# Altium project TMDX654GPEVM.PrjPcb (part 11 of 24)

## Sheet 28-MIPI 60 PIN CONNECTOR.SchDoc
size 513 x 386 mm
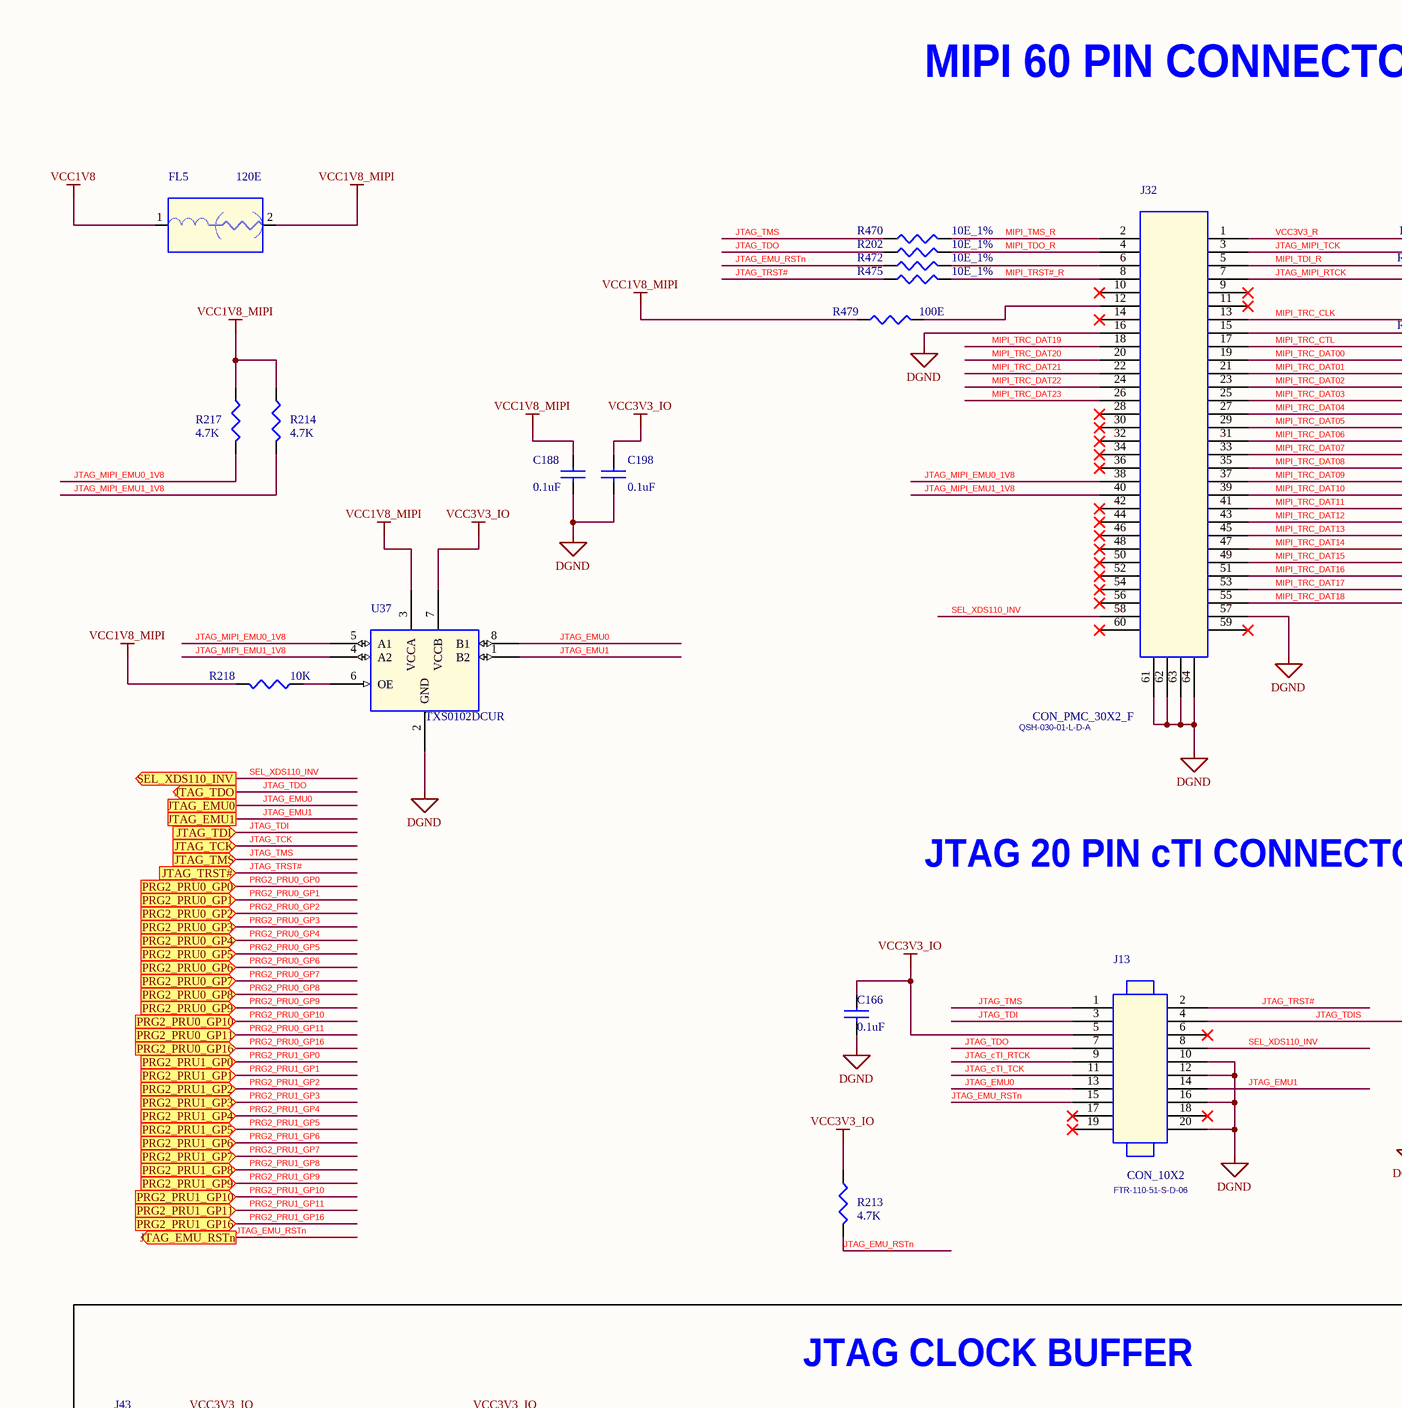
[diagram p48: 28-MIPI 60 PIN CONNECTOR.SchDoc, top left]
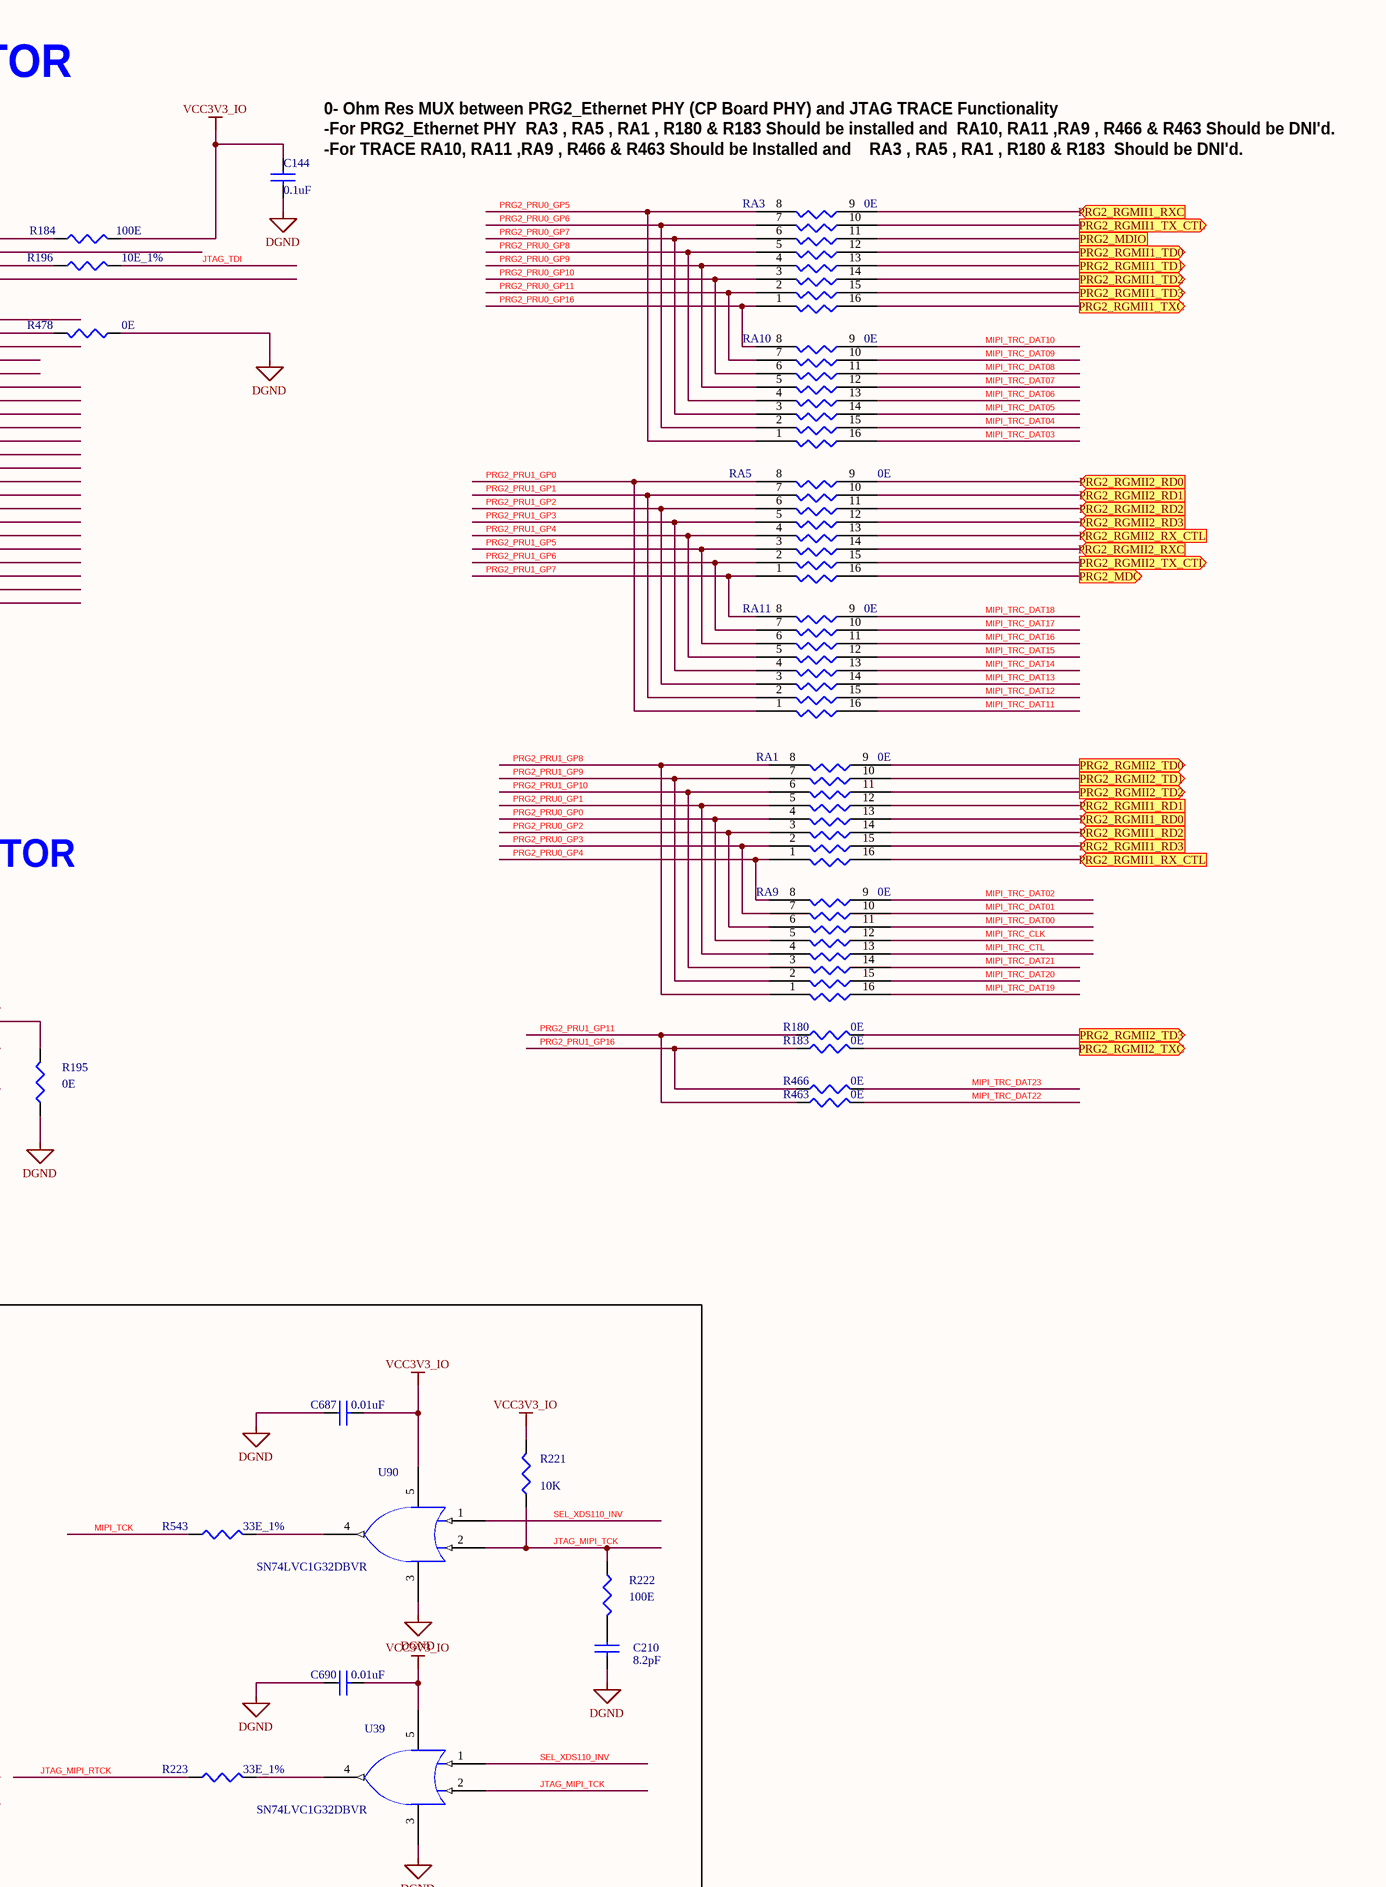
[diagram p49: 28-MIPI 60 PIN CONNECTOR.SchDoc, top right]
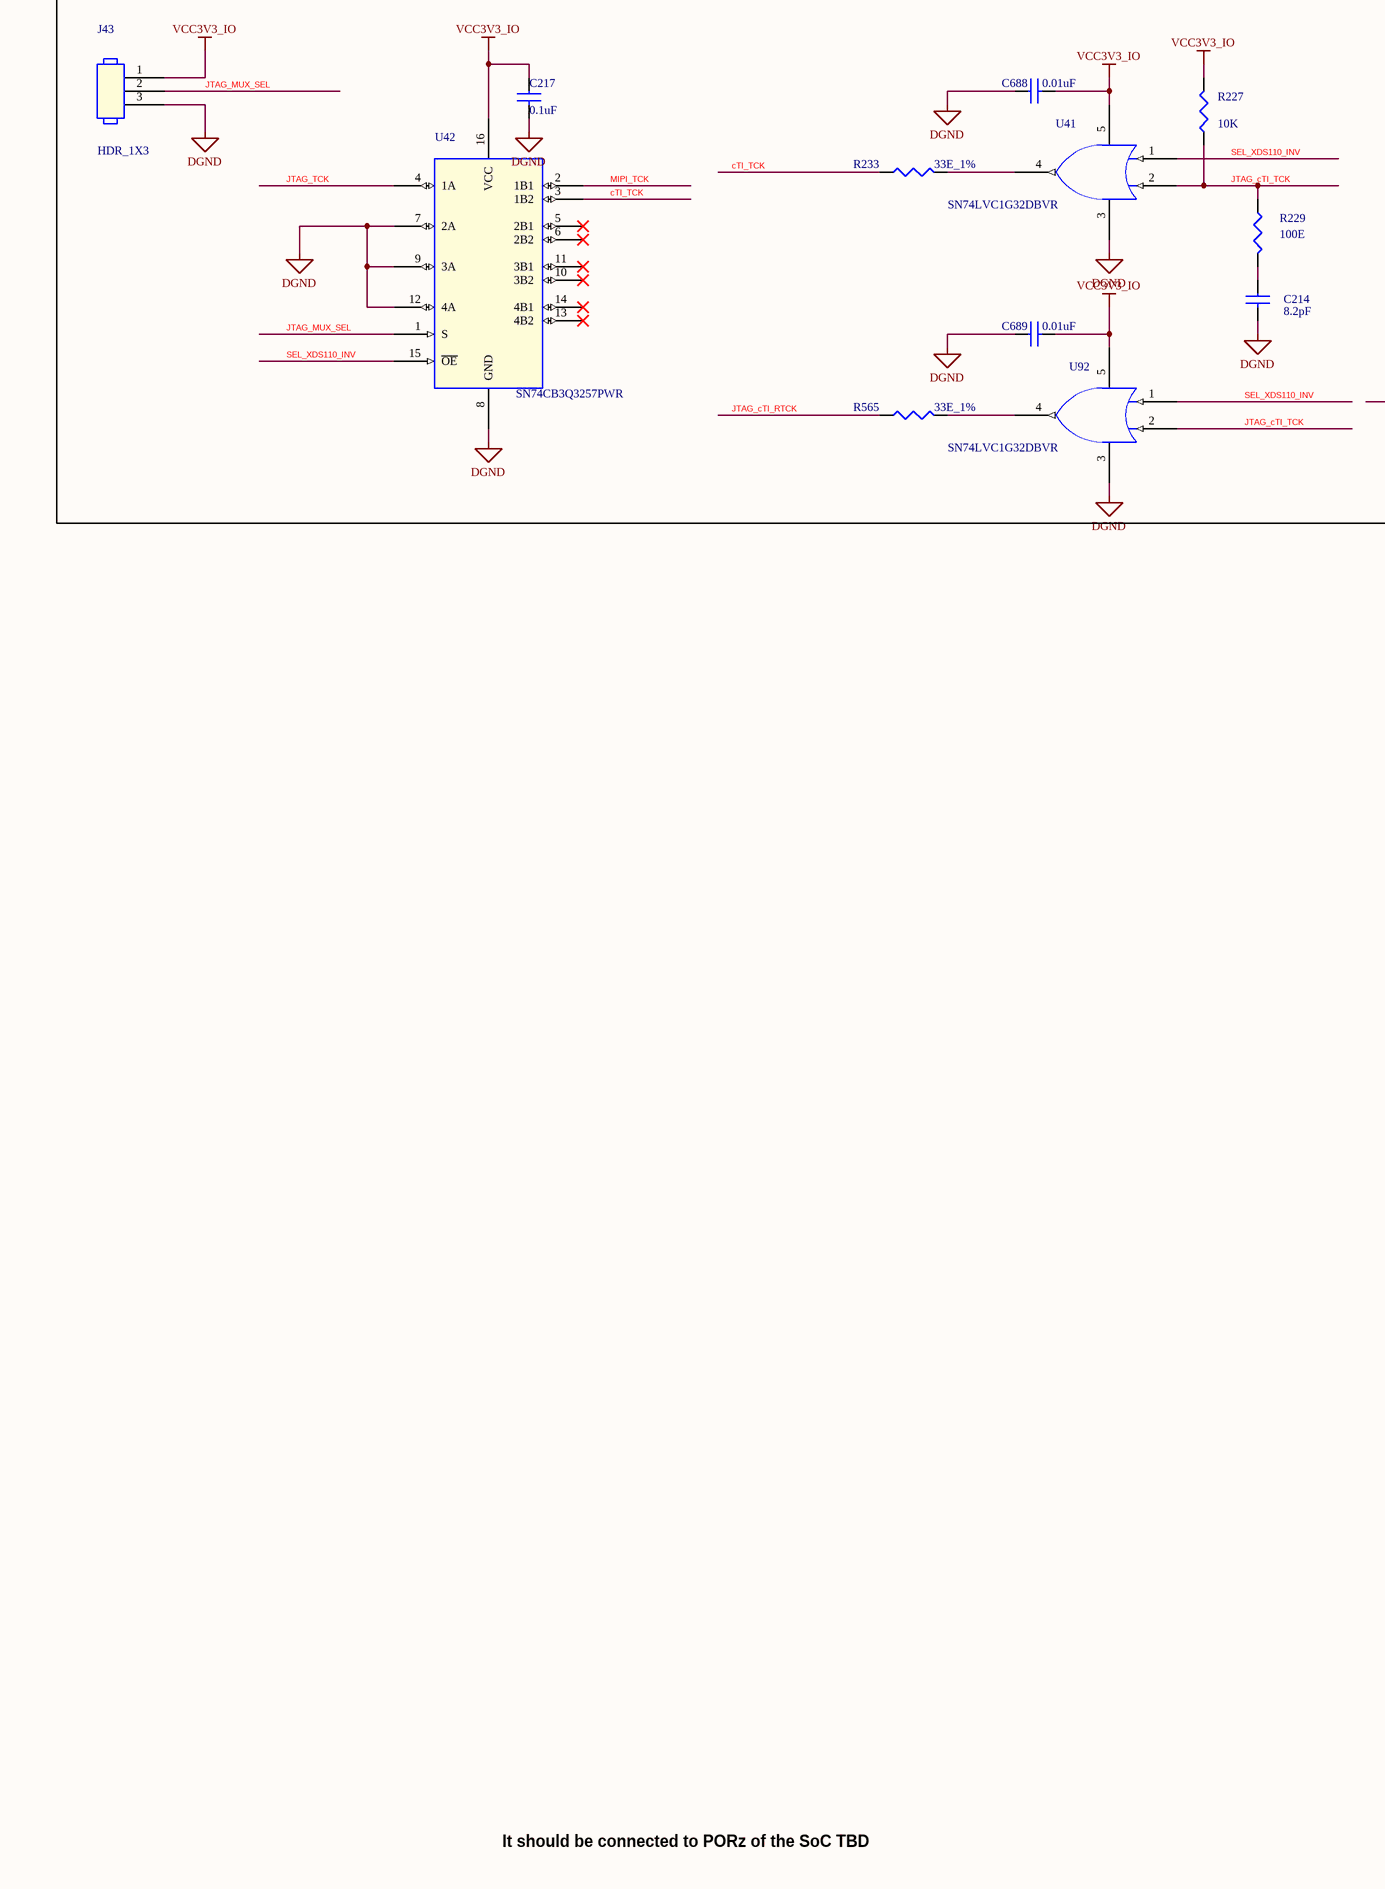
[diagram p50: 28-MIPI 60 PIN CONNECTOR.SchDoc, bottom left]
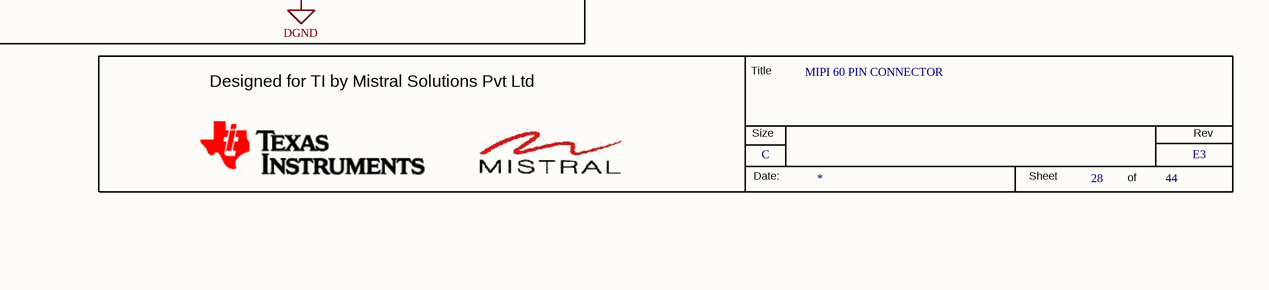
[diagram p51: 28-MIPI 60 PIN CONNECTOR.SchDoc, bottom right]

### Parts
(Parts that share a designator on the sheet are numbered #1, #2 ... from top to bottom, then left to right.)
*#28  RevCode: E3  Title: MIPI 60 PIN CONNECTOR  Page Size: C  Page Number: 28  Page Count: 44  (hidden comment: MISTRAL_TITLEBLK_CSIZE)  (graphical)
C144  0.1uF  [CAP0201_0-5]
C166  0.1uF  [CAP0201_0-5]
C188  0.1uF  [CAP0201_0-5]
C198  0.1uF  [CAP0201_0-5]
C210  8.2pF  [CAP0402_0-75]
C214  8.2pF  [CAP0402_0-75]
C217  0.1uF  [CAP0201_0-5]
C687  0.01uF  [CAP0201_0-5]
C688  0.01uF  [CAP0201_0-5]
C689  0.01uF  [CAP0201_0-5]
C690  0.01uF  [CAP0201_0-5]
FL5  120E  [EMIFIL_BLM15A_0402_0-6]
J13  CON_10X2  Mfr_part_number: FTR-110-51-S-D-06  [CON_10X2_FTR-110-51-S-D_P_S_S]
J32  CON_PMC_30X2_F  Mfr_part_number: QSH-030-01-L-D-A  [CON_PMC30X2_QSH-030-01-L_S_S_S]
J43  HDR_1X3  [HDR_3X1_100_S_T]
R180  0E  [RES0402_0-5]
R183  0E  [RES0402_0-5]
R184  100E  [RES0402_0-5]
R195  0E  [RES0402_0-5]
R196  10E_1%  [RES0402_0-5]
R202  10E_1%  [RES0402_0-5]
R213  4.7K  [RES0402]
R214  4.7K  [RES0402]
R217  4.7K  [RES0402]
R218  10K  [RES0402_0-5]
R221  10K  [RES0402_0-5]
R222  100E  [RES0402_0-5]
R223  33E_1%  [RES0402_0-5]
R227  10K  [RES0402_0-5]
R229  100E  [RES0402_0-5]
R233  33E_1%  [RES0402_0-5]
R463  0E  [RES0402_0-5]
R466  0E  [RES0402_0-5]
R470  10E_1%  [RES0402_0-5]
R472  10E_1%  [RES0402_0-5]
R475  10E_1%  [RES0402_0-5]
R478  0E  [RES0402_0-5]
R479  100E  [RES0402_0-5]
R543  33E_1%  [RES0402_0-5]
R565  33E_1%  [RES0402_0-5]
RA1  0E  [RESA_0402-8]
RA3  0E  [RESA_0402-8]
RA5  0E  [RESA_0402-8]
RA9  0E  [RESA_0402-8]
RA10  0E  [RESA_0402-8]
RA11  0E  [RESA_0402-8]
U37  TXS0102DCUR  [VSSOP8_19-68_85X95_0-9]
U39  SN74LVC1G32DBVR  [SOT23-5_1-5]
U41  SN74LVC1G32DBVR  [SOT23-5_1-5]
U42  SN74CB3Q3257PWR  [TSSOP16_25-59_205X180]
U90  SN74LVC1G32DBVR  [SOT23-5_1-5]
U92  SN74LVC1G32DBVR  [SOT23-5_1-5]

### Blocks framed on the sheet
JTAG CLOCK BUFFER: C210 C214 C217 C687-C690 J43 R221-R223 R227 R229 R233 R543 R565 U39 U41 U42 U90 U92

### Ports
JTAG_EMU0, JTAG_EMU1, JTAG_EMU_RSTn (out), JTAG_TCK (in), JTAG_TDI (in), JTAG_TDO (out), JTAG_TMS (in), JTAG_TRST# (in), PRG2_MDC (out), PRG2_MDIO, PRG2_PRU0_GP0 (in), PRG2_PRU0_GP1 (in), PRG2_PRU0_GP2 (in), PRG2_PRU0_GP3 (in), PRG2_PRU0_GP4 (in), PRG2_PRU0_GP5 (in), PRG2_PRU0_GP6 (in), PRG2_PRU0_GP7 (in), PRG2_PRU0_GP8 (in), PRG2_PRU0_GP9 (in), PRG2_PRU0_GP10 (in), PRG2_PRU0_GP11 (in), PRG2_PRU0_GP16 (in), PRG2_PRU1_GP0 (in), PRG2_PRU1_GP1 (in), PRG2_PRU1_GP2 (in), PRG2_PRU1_GP3 (in), PRG2_PRU1_GP4 (in), PRG2_PRU1_GP5 (in), PRG2_PRU1_GP6 (in), PRG2_PRU1_GP7 (in), PRG2_PRU1_GP8 (in), PRG2_PRU1_GP9 (in), PRG2_PRU1_GP10 (in), PRG2_PRU1_GP11 (in), PRG2_PRU1_GP16 (in), PRG2_RGMII1_RD0 (in), PRG2_RGMII1_RD1 (in), PRG2_RGMII1_RD2 (in), PRG2_RGMII1_RD3 (in), PRG2_RGMII1_RX_CTL (in), PRG2_RGMII1_RXC (in), PRG2_RGMII1_TD0 (out), PRG2_RGMII1_TD1 (out), PRG2_RGMII1_TD2 (out), PRG2_RGMII1_TD3 (out), PRG2_RGMII1_TX_CTL (out), PRG2_RGMII1_TXC (out), PRG2_RGMII2_RD0 (in), PRG2_RGMII2_RD1 (in), PRG2_RGMII2_RD2 (in), PRG2_RGMII2_RD3 (in), PRG2_RGMII2_RX_CTL (in), PRG2_RGMII2_RXC (in), PRG2_RGMII2_TD0 (out), PRG2_RGMII2_TD1 (out), PRG2_RGMII2_TD2 (out), PRG2_RGMII2_TD3 (out), PRG2_RGMII2_TX_CTL (out), PRG2_RGMII2_TXC (out), SEL_XDS110_INV (out)

### Nets
DGND: C144.2 C166.2 C188.2 C198.2 C210.2 C214.2 C217.2 C687.1 C688.1 C689.1 C690.1 J13.10 J13.12 J13.16 J13.20 J32.16 J32.57 J32.61 J32.62 J32.63 J32.64 J43.3 R195.1 R478.1 U37.2(GND) U39.3(GND) U41.3(GND) U42.7(2A) U42.8(GND) U42.9(3A) U42.12(4A) U90.3(GND) U92.3(GND)
VCC1V8: FL5.1
VCC1V8_MIPI: C188.1 FL5.2 R214.1 R217.1 R218.2 R479.1 U37.3(VCCA)
VCC3V3_IO: C144.1 C166.1 C198.1 C217.1 C687.2 C688.2 C689.2 C690.2 J13.5 J43.1 R184.2 R213.1 R221.2 R227.2 U37.7(VCCB) U39.5(VCC) U41.5(VCC) U42.16(VCC) U90.5(VCC) U92.5(VCC)
cTI_TCK: R233.1 U42.3(1B2)
JTAG_cTI_RTCK: J13.9 R565.1
JTAG_cTI_TCK: J13.11 R227.1 R229.1 U41.2(B) U92.2(B)
JTAG_EMU0: J13.13 U37.8(B1) ; port JTAG_EMU0
JTAG_EMU1: J13.14 U37.1(B2) ; port JTAG_EMU1
JTAG_EMU_RSTn: J13.15 R213.2 R472.1 ; port JTAG_EMU_RSTn
JTAG_MIPI_EMU0_1V8: J32.38 R217.2 U37.5(A1)
JTAG_MIPI_EMU1_1V8: J32.40 R214.2 U37.4(A2)
JTAG_MIPI_RTCK: J32.7 R223.1
JTAG_MIPI_TCK: J32.3 R221.1 R222.1 U39.2(B) U90.2(B)
JTAG_MUX_SEL: J43.2 U42.1(S)
JTAG_TCK: U42.4(1A) ; port JTAG_TCK
JTAG_TDI: J13.3 R196.2 ; port JTAG_TDI
JTAG_TDIS: J13.4 R195.2
JTAG_TDO: J13.7 R202.1 ; port JTAG_TDO
JTAG_TMS: J13.1 R470.1 ; port JTAG_TMS
JTAG_TRST#: J13.2 R475.1 ; port JTAG_TRST#
MIPI_TCK: R543.1 U42.2(1B1)
MIPI_TDI_R: J32.5 R196.1
MIPI_TDO_R: J32.4 R202.2
MIPI_TMS_R: J32.2 R470.2
MIPI_TRC_CLK: J32.13 RA9.12
MIPI_TRC_CTL: J32.17 RA9.13
MIPI_TRC_DAT00: J32.19 RA9.11
MIPI_TRC_DAT01: J32.21 RA9.10
MIPI_TRC_DAT02: J32.23 RA9.9
MIPI_TRC_DAT03: J32.25 RA10.16
MIPI_TRC_DAT04: J32.27 RA10.15
MIPI_TRC_DAT05: J32.29 RA10.14
MIPI_TRC_DAT06: J32.31 RA10.13
MIPI_TRC_DAT07: J32.33 RA10.12
MIPI_TRC_DAT08: J32.35 RA10.11
MIPI_TRC_DAT09: J32.37 RA10.10
MIPI_TRC_DAT10: J32.39 RA10.9
MIPI_TRC_DAT11: J32.41 RA11.16
MIPI_TRC_DAT12: J32.43 RA11.15
MIPI_TRC_DAT13: J32.45 RA11.14
MIPI_TRC_DAT14: J32.47 RA11.13
MIPI_TRC_DAT15: J32.49 RA11.12
MIPI_TRC_DAT16: J32.51 RA11.11
MIPI_TRC_DAT17: J32.53 RA11.10
MIPI_TRC_DAT18: J32.55 RA11.9
MIPI_TRC_DAT19: J32.18 RA9.16
MIPI_TRC_DAT20: J32.20 RA9.15
MIPI_TRC_DAT21: J32.22 RA9.14
MIPI_TRC_DAT22: J32.24 R463.2
MIPI_TRC_DAT23: J32.26 R466.2
MIPI_TRST#_R: J32.8 R475.2
PRG2_MDC: RA5.16 ; port PRG2_MDC
PRG2_MDIO: RA3.11 ; port PRG2_MDIO
PRG2_PRU0_GP0: RA1.4 RA9.5 ; port PRG2_PRU0_GP0
PRG2_PRU0_GP1: RA1.5 RA9.4 ; port PRG2_PRU0_GP1
PRG2_PRU0_GP2: RA1.3 RA9.6 ; port PRG2_PRU0_GP2
PRG2_PRU0_GP3: RA1.2 RA9.7 ; port PRG2_PRU0_GP3
PRG2_PRU0_GP4: RA1.1 RA9.8 ; port PRG2_PRU0_GP4
PRG2_PRU0_GP5: RA3.8 RA10.1 ; port PRG2_PRU0_GP5
PRG2_PRU0_GP6: RA3.7 RA10.2 ; port PRG2_PRU0_GP6
PRG2_PRU0_GP7: RA3.6 RA10.3 ; port PRG2_PRU0_GP7
PRG2_PRU0_GP8: RA3.5 RA10.4 ; port PRG2_PRU0_GP8
PRG2_PRU0_GP9: RA3.4 RA10.5 ; port PRG2_PRU0_GP9
PRG2_PRU0_GP10: RA3.3 RA10.6 ; port PRG2_PRU0_GP10
PRG2_PRU0_GP11: RA3.2 RA10.7 ; port PRG2_PRU0_GP11
PRG2_PRU0_GP16: RA3.1 RA10.8 ; port PRG2_PRU0_GP16
PRG2_PRU1_GP0: RA5.8 RA11.1 ; port PRG2_PRU1_GP0
PRG2_PRU1_GP1: RA5.7 RA11.2 ; port PRG2_PRU1_GP1
PRG2_PRU1_GP2: RA5.6 RA11.3 ; port PRG2_PRU1_GP2
PRG2_PRU1_GP3: RA5.5 RA11.4 ; port PRG2_PRU1_GP3
PRG2_PRU1_GP4: RA5.4 RA11.5 ; port PRG2_PRU1_GP4
PRG2_PRU1_GP5: RA5.3 RA11.6 ; port PRG2_PRU1_GP5
PRG2_PRU1_GP6: RA5.2 RA11.7 ; port PRG2_PRU1_GP6
PRG2_PRU1_GP7: RA5.1 RA11.8 ; port PRG2_PRU1_GP7
PRG2_PRU1_GP8: RA1.8 RA9.1 ; port PRG2_PRU1_GP8
PRG2_PRU1_GP9: RA1.7 RA9.2 ; port PRG2_PRU1_GP9
PRG2_PRU1_GP10: RA1.6 RA9.3 ; port PRG2_PRU1_GP10
PRG2_PRU1_GP11: R180.1 R463.1 ; port PRG2_PRU1_GP11
PRG2_PRU1_GP16: R183.1 R466.1 ; port PRG2_PRU1_GP16
PRG2_RGMII1_RD0: RA1.13 ; port PRG2_RGMII1_RD0
PRG2_RGMII1_RD1: RA1.12 ; port PRG2_RGMII1_RD1
PRG2_RGMII1_RD2: RA1.14 ; port PRG2_RGMII1_RD2
PRG2_RGMII1_RD3: RA1.15 ; port PRG2_RGMII1_RD3
PRG2_RGMII1_RX_CTL: RA1.16 ; port PRG2_RGMII1_RX_CTL
PRG2_RGMII1_RXC: RA3.9 ; port PRG2_RGMII1_RXC
PRG2_RGMII1_TD0: RA3.12 ; port PRG2_RGMII1_TD0
PRG2_RGMII1_TD1: RA3.13 ; port PRG2_RGMII1_TD1
PRG2_RGMII1_TD2: RA3.14 ; port PRG2_RGMII1_TD2
PRG2_RGMII1_TD3: RA3.15 ; port PRG2_RGMII1_TD3
PRG2_RGMII1_TX_CTL: RA3.10 ; port PRG2_RGMII1_TX_CTL
PRG2_RGMII1_TXC: RA3.16 ; port PRG2_RGMII1_TXC
PRG2_RGMII2_RD0: RA5.9 ; port PRG2_RGMII2_RD0
PRG2_RGMII2_RD1: RA5.10 ; port PRG2_RGMII2_RD1
PRG2_RGMII2_RD2: RA5.11 ; port PRG2_RGMII2_RD2
PRG2_RGMII2_RD3: RA5.12 ; port PRG2_RGMII2_RD3
PRG2_RGMII2_RX_CTL: RA5.13 ; port PRG2_RGMII2_RX_CTL
PRG2_RGMII2_RXC: RA5.14 ; port PRG2_RGMII2_RXC
PRG2_RGMII2_TD0: RA1.9 ; port PRG2_RGMII2_TD0
PRG2_RGMII2_TD1: RA1.10 ; port PRG2_RGMII2_TD1
PRG2_RGMII2_TD2: RA1.11 ; port PRG2_RGMII2_TD2
PRG2_RGMII2_TD3: R180.2 ; port PRG2_RGMII2_TD3
PRG2_RGMII2_TX_CTL: RA5.15 ; port PRG2_RGMII2_TX_CTL
PRG2_RGMII2_TXC: R183.2 ; port PRG2_RGMII2_TXC
SEL_XDS110_INV: J13.8 J32.58 U39.1(A) U41.1(A) U42.15(~{OE}) U90.1(A) U92.1(A) ; port SEL_XDS110_INV
VCC3V3_R: J32.1 R184.1
NetC210_1: C210.1 R222.2
NetC214_1: C214.1 R229.2
NetJ32_6: J32.6 R472.2
NetJ32_12: J32.12 R479.2
NetJ32_15: J32.15 R478.2
NetR218_1: R218.1 U37.6(OE)
NetR223_2: R223.2 U39.4(Y)
NetR233_2: R233.2 U41.4(Y)
NetR543_2: R543.2 U90.4(Y)
NetR565_2: R565.2 U92.4(Y)

Not connected (* = marked no-connect by the designer): J13 6* 17* 18* 19*; J32 9* 10* 11* 14* 28* 30* 32* 34* 36* 42* 44* 46* 48* 50* 52* 54* 56* 59* 60*; U42 5(2B1)* 6(2B2)* 10(3B2)* 11(3B1)* 13(4B2)* 14(4B1)*

### Notes on the sheet
- MIPI 60 PIN CONNECTOR
- 0- Ohm Res MUX between PRG2_Ethernet PHY (CP Board PHY) and JTAG TRACE Functionality
  -For PRG2_Ethernet PHY  RA3 , RA5 , RA1 , R180 & R183 Should be installed and  RA10, RA11 ,RA9 , R466 & R463 Should be DNI'd.
  -For TRACE RA10, RA11 ,RA9 , R466 & R463 Should be Installed and    RA3 , RA5 , RA1 , R180 & R183  Should be DNI'd.
- JTAG 20 PIN cTI CONNECTOR
- It should be connected to PORz of the SoC TBD
- (in symbol MISTRAL_TITLEBLK_CSIZE) Title; Designed for TI by Mistral Solutions Pvt Ltd; Size; Rev; Date:; Sheet; of

### Library data of the parts
*#28 = MISTRAL_TITLEBLK_CSIZE: Issue: 1.0; Page Create Date: March  8, 1995; Page Modify Date: *
C144 C166 C198 = CAP_Dup5: CAP CERAMIC 0.1uF 16V 10% X5R 0201; Mistral Part No: 120009030072-R; Mfr_name: MURATA; Mfr_part_number: GRM033R61C104KE84J; Part_type: CAPACITORS\CERAMIC; Project: TI_MAXIE_CPB; Wattage: NA; Customs_HS_Code: 85322990; Custom_Duty: 15%; Library Ref: CAP; Tolerance: 10%; Voltage: 16V; Package: 0201; Distributor_name: DIGIKEY; Distributor_part_number: 490-16742-1-ND; Height: 0.33MM; Weight: 0.33mg; Temperature: -55°C+85°C; Datasheet: Y:\MIS_DATABASE\DATASHEETS\CAPACITORS\GRM033R61C104KE84.PDF; Crtd /date: MANIRAJA/120218; Chkd/date: MANIRAJA/120218; MECHANICAL 3D STEP FILE: CAP0201_0-5; PCB Footprint: CAP0201_0-5
C188 = CAP_Dup5: CAP CERAMIC 0.1uF 16V 10% X5R 0201; Part_type: CAPACITORS\CERAMIC; Mfr_part_number: GRM033R61C104KE84J; Mfr_name: MURATA; Mistral Part No: 120009030072-R; Custom_Duty: 15%; Customs_HS_Code: 85322990; Wattage: NA; Project: TI_MAXIE_CPB; Library Ref: CAP; MECHANICAL 3D STEP FILE: CAP0201_0-5; Chkd/date: MANIRAJA/120218; Crtd /date: MANIRAJA/120218; Datasheet: Y:\MIS_DATABASE\DATASHEETS\CAPACITORS\GRM033R61C104KE84.PDF; Temperature: -55°C+85°C; Weight: 0.33mg; Height: 0.33MM; Distributor_part_number: 490-16742-1-ND; Distributor_name: DIGIKEY; Package: 0201; Voltage: 16V; Tolerance: 10%; PCB Footprint: CAP0201_0-5
C210 C214 = CAP_Dup5: CAP CERAMIC 8.2pF 50V 0.5pF C0G(NP0) 0402; Part_type: CAPACITORS\CERAMIC; Mfr_part_number: GCM1555C1H8R2DA16D; Mfr_name: MURATA; Mistral Part No: 120018010017-R; Wattage: NA; Custom_Duty: 15%; Customs_HS_Code: 85322990; Tolerance: 0.5pF%; Project: TI_MAXIE_CPB; Library Ref: CAP; MECHANICAL 3D STEP FILE: CAP0402_0-75; PCB Footprint: CAP0402_0-75; Chkd/date: MANIRAJA/240118; Crtd /date: MANIRAJA/240118; Datasheet: Y:\MIS_DATABASE\DATASHEETS\CAPACITORS\MURATA-GCM-SER.PDF; Temperature: -55°C+125°C; Weight: 6mg; Height: 0.55MM; Distributor_part_number: GCM1555C1H8R2DA16D-ND; Distributor_name: DIGIKEY; Package: 0402; Voltage: 50V
C217 = CAP_Dup4: CAP CERAMIC 0.1uF 16V 10% X5R 0201; Part_type: CAPACITORS\CERAMIC; Mfr_part_number: GRM033R61C104KE84J; Mfr_name: MURATA; Mistral Part No: 120009030072-R; Custom_Duty: 15%; Customs_HS_Code: 85322990; Wattage: NA; Project: TI_MAXIE_CPB; Library Ref: CAP; PCB Footprint: CAP0201_0-5; MECHANICAL 3D STEP FILE: CAP0201_0-5; Temperature: -55°C+85°C; Chkd/date: MANIRAJA/120218; Crtd /date: MANIRAJA/120218; Datasheet: Y:\MIS_DATABASE\DATASHEETS\CAPACITORS\GRM033R61C104KE84.PDF; Weight: 0.33mg; Height: 0.33MM; Distributor_part_number: 490-16742-1-ND; Distributor_name: DIGIKEY; Package: 0201; Voltage: 16V; Tolerance: 10%
C687-C690 = CAP_Dup5: CAP CERAMIC 0.01uF 25V 10% X5R 0201; Part_type: CAPACITORS\CERAMIC; Mfr_part_number: GRM033R61E103KA12J; Mfr_name: MURATA; Mistral Part No: 120018010007-R; Custom_Duty: 15%; Customs_HS_Code: 85322990; Project: TI_MAXIE_CPB; Wattage: NA; Library Ref: CAP; Chkd/date: MANIRAJA/230118; Crtd /date: MANIRAJA/230118; Datasheet: Y:\MIS_DATABASE\DATASHEETS\CAPACITORS\GRM033R61E103KA12.PDF; Height: 0.33MM; Distributor_part_number: GRM033R61E103KA12J-ND; Distributor_name: DIGIKEY; Package: 0201; Voltage: 25V; Tolerance: 10%; Weight: 0.33mg; Temperature: -55°C+85°C; MECHANICAL 3D STEP FILE: CAP0201_0-5; PCB Footprint: CAP0201_0-5
FL5 = EMIFILTER_IND: FERRITE CHIP 120E 1.3A 0402; Part_type: MISC\FILTER; Mfr_part_number: BLM15PD121SN1; Mfr_name: MURATA; Mistral Part No: 130012030043-R; Custom_Duty: 24%; Customs_HS_Code: 85437099; Wattage: NA; Tolerance: 25%; Project: GEN_3-8; Footprint Path: Y:\MIS_DATABASE\Library\ALTIUM_TOOL\PCB_FOOTPRINTS\Altium_Footprint_Lib.PcbLib; Library Path: Y:\MIS_DATABASE\Library\ALTIUM_TOOL\SCHEMATICS_PARTS\MS_FILTER_Library.schlib; Footprint Ref: EMIFIL_BLM15A_0402_0-6; Library Ref: EMIFILTER_IND; MECHANICAL 3D STEP FILE: EMIFIL_BLM15A_0402_0-6; Chkd/date: VASANTHA/010117; Crtd /date: CHAITHANYA/150312; Datasheet: Y:\MIS_DATABASE\DATASHEETS\DISCRETES\INDUCTORS\BLM18K-SERIES.PDF; Temperature: -55°C+125°C; Weight: 0.65mg; Height: 0.55MM; Distributor_part_number: 490-5203-1-ND; Distributor_name: DIGIKEY; Package: 0402; Voltage: NA; PCB Footprint: EMIFIL_BLM15A_0402_0-6
J13 = CON_10X2: CON 10X2 1.27MM PITCH MALE SMD; Part_type: CONNECTOR\MISCELLANEOUS; Mfr_name: SAMTEC; Mistral Part No: 150011090001-R; Custom_Duty: 24%; Customs_HS_Code: 85369090; Wattage: NA; Project: GEMYC; Library Ref: CON_10X2; Chkd/date: BAVISH/050911; Crtd /date: CHAITHANYA/050811; Datasheet: Y:\MIS_DATABASE\DATASHEETS\CONNECTORS\FTR-SERIES1.PDF; Temperature: -55°C+105°C; Weight: NA; Height: 7.37MM; Distributor_part_number: FTR-110-51-S-D-06-ND; Distributor_name: DIGIKEY; Package: SMD; Voltage: NA; Tolerance: NA; PCB Footprint: CON_10X2_FTR-110-51-S-D_P_S_S
J32 = CON_PMC_30X2_F: CON PMC 30X2 0.50MM PITCH FEMALE ST SMD; Mistral Part No: 150009030606; Mfr_name: SAMTEC; Part_type: CONNECTOR\PMC; Project: KHAN_HSST; Customs_HS_Code: 85369090; Custom_Duty: 24%; NI_MARK: DNI; Library Ref: CON_PMC_30X2_F; Package: SMD; Height: 3.25MM; Datasheet: Y:\MIS_DATABASE\DATASHEETS\CONNECTORS\QSH.PDF; Crtd /date: USMAN/051108; Chkd/date: MAZHAR/180208; PCB Footprint: CON_PMC30X2_QSH-030-01-L_S_S_S
J43 = HEADER_3X1: HDR 1X3 2.54MM PITCH ST TH; Part_type: CONNECTOR\HEADERS; Mfr_part_number: 68001-403HLF; Mfr_name: FCI; Mistral Part No: 150016060025-R; Custom_Duty: 15%; Customs_HS_Code: 85322990; Wattage: NA; Project: IKEYP; Library Ref: HEADER_3X1; PCB Footprint: HDR_3X1_100_S_T; Chkd/date: VASANTHA/290616; Crtd /date: VASANTHA/290616; Datasheet: Y:\MIS_DATABASE\DATASHEETS\CONNECTORS\68000.PDF; Temperature: -40°C+105°C; Weight: NA; Height: 8.58MM; Distributor_part_number: 609-3471-ND; Distributor_name: DIGIKEY; Package: THRU-HOLE; Voltage: NA; Tolerance: NA
R180 R195 = RESISTOR_Dup4: RES 0E 1/16W 0402; Part_type: RESISTORS\FIXED; Mfr_part_number: CRCW04020000Z0ED; Mfr_name: VISHAY; Mistral Part No: 110010080019-P; Custom_Duty: 15%; Customs_HS_Code: 85332119; Voltage: NA; Project: PB_BUGBASE; Footprint Path: Y:\MIS_DATABASE\Library\ALTIUM_TOOL\PCB_FOOTPRINTS\Altium_Footprint_Lib.PcbLib; Library Path: Y:\MIS_DATABASE\Library\ALTIUM_TOOL\SCHEMATICS_PARTS\MS_DISCRETE_Library.schlib; Footprint Ref: RES0402_0-5; Library Ref: RESISTOR; MECHANICAL 3D STEP FILE: RES0402_0-5; RoHS: Pb-Free; Chkd/date: VASANTHA/201216; Crtd /date: MUDDU/190810; Datasheet: Y:\MIS_DATABASE\DATASHEETS\RESISTORS\CRCW0603.PDF; Temperature: -55°C+155°C; Weight: 0.65g/1000pcs; Height: 0.40MM; Distributor_part_number: 541-0.0JCT-ND; Distributor_name: DIGIKEY; Package: 0402; Wattage: 1/16W; Tolerance: NA; PCB Footprint: RES0402_0-5
  R180: SIGNAL_MODEL: RES
R183 = RESISTOR_Dup4: RES 0E 1/16W 0402; Mistral Part No: 110010080019-P; Mfr_name: VISHAY; Mfr_part_number: CRCW04020000Z0ED; Part_type: RESISTORS\FIXED; Project: PB_BUGBASE; Tolerance: NA; Customs_HS_Code: 85332119; Custom_Duty: 15%; Footprint Path: Y:\MIS_DATABASE\Library\ALTIUM_TOOL\PCB_FOOTPRINTS\Altium_Footprint_Lib.PcbLib; Library Path: Y:\MIS_DATABASE\Library\ALTIUM_TOOL\SCHEMATICS_PARTS\MS_DISCRETE_Library.schlib; Footprint Ref: RES0402_0-5; Library Ref: RESISTOR; SIGNAL_MODEL: RES; MECHANICAL 3D STEP FILE: RES0402_0-5; Voltage: NA; Wattage: 1/16W; Package: 0402; Distributor_name: DIGIKEY; Distributor_part_number: 541-0.0JCT-ND; Height: 0.40MM; Weight: 0.65g/1000pcs; Temperature: -55°C+155°C; Datasheet: Y:\MIS_DATABASE\DATASHEETS\RESISTORS\CRCW0603.PDF; Crtd /date: MUDDU/190810; Chkd/date: VASANTHA/201216; RoHS: Pb-Free; PCB Footprint: RES0402_0-5
R184 R479 = RESISTOR_Dup1: RES 100E 1/16W 5% 0402; Part_type: RESISTORS\FIXED; Mfr_part_number: CRCW0402100RJNED; Mfr_name: VISHAY; Mistral Part No: 110009030164-R; Custom_Duty: 15%; Customs_HS_Code: 85332119; Voltage: NA; Project: TI_MAXIE_CPB; Library Ref: RESISTOR; MECHANICAL 3D STEP FILE: RES0402_0-5; Chkd/date: MANIRAJA/230817; Crtd /date: MANIRAJA/230817; Datasheet: Y:\MIS_DATABASE\DATASHEETS\RESISTORS\CRCW0603.PDF; Temperature: -55°C+155°C; Weight: 0.65mg; Height: 0.40MM; Distributor_part_number: 541-100JCT-ND; Distributor_name: DIGIKEY; Package: 0402; Wattage: 1/16W; Tolerance: 5%; PCB Footprint: RES0402_0-5
R196 R470 R472 = RESISTOR_Dup2: RES 10E 1/16W 1% 0402; Mistral Part No: 110018020004-R; Mfr_name: YAGEO AMERICA; Mfr_part_number: RC0402FR-0710RL; Part_type: RESISTORS\FIXED; Voltage: NA; Project: TI_MAXIE_CPB; Customs_HS_Code: 85332119; Custom_Duty: 15%; Library Ref: RESISTOR; MECHANICAL 3D STEP FILE: RES0402_0-5; Temperature: -55°C+155°C; Weight: 0.65mg; Tolerance: 1%; Wattage: 1/16W; Package: 0402; Distributor_name: DIGIKEY; Distributor_part_number: 311-10.0LRCT-ND; Height: 0.40MM; Datasheet: Y:\MIS_DATABASE\DATASHEETS\RESISTORS\YAGEO-RC0402.PDF; Crtd /date: ALVY/070218; Chkd/date: MANIRAJA/070218; PCB Footprint: RES0402_0-5
R202 R475 = RESISTOR_Dup2: RES 10E 1/16W 1% 0402; Part_type: RESISTORS\FIXED; Mfr_part_number: RC0402FR-0710RL; Mfr_name: YAGEO AMERICA; Mistral Part No: 110018020004-R; Voltage: NA; Custom_Duty: 15%; Customs_HS_Code: 85332119; Project: TI_MAXIE_CPB; Library Ref: RESISTOR; MECHANICAL 3D STEP FILE: RES0402_0-5; Temperature: -55°C+155°C; Weight: 0.65mg; Chkd/date: MANIRAJA/070218; Crtd /date: ALVY/070218; Datasheet: Y:\MIS_DATABASE\DATASHEETS\RESISTORS\YAGEO-RC0402.PDF; Height: 0.40MM; Distributor_part_number: 311-10.0LRCT-ND; Distributor_name: DIGIKEY; Package: 0402; Wattage: 1/16W; Tolerance: 1%; PCB Footprint: RES0402_0-5
R213 R217 = RESISTOR_Dup3: RES 4.7K 1/16W 5% 0402; Mistral Part No: 110009030792-R; Mfr_name: YAGEO AMERICA; Mfr_part_number: RC0402JR-074K7L; Part_type: RESISTORS\FIXED; Project: TMDXCSK368; Voltage: NA; Customs_HS_Code: 85332119; Custom_Duty: 15%; Library Ref: RESISTOR; Tolerance: 5%; Wattage: 1/16W; Package: 0402; Distributor_name: DIGIKEY; Distributor_part_number: 311-4.7KJRCT-ND; Height: 0.55MM; Weight: NA; Temperature: -55°C+155°C; Datasheet: Y:\MIS_DATABASE\DATASHEETS\RESISTORS\YAGEO-RC0402.PDF; Crtd /date: VASANTHA/130516; Chkd/date: VASANTHA/130516; PCB Footprint: RES0402
R214 = RESISTOR_Dup3: RES 4.7K 1/16W 5% 0402; Part_type: RESISTORS\FIXED; Mfr_part_number: RC0402JR-074K7L; Mfr_name: YAGEO AMERICA; Mistral Part No: 110009030792-R; Custom_Duty: 15%; Customs_HS_Code: 85332119; Voltage: NA; Project: TMDXCSK368; Library Ref: RESISTOR; Chkd/date: VASANTHA/130516; Crtd /date: VASANTHA/130516; Datasheet: Y:\MIS_DATABASE\DATASHEETS\RESISTORS\YAGEO-RC0402.PDF; Temperature: -55°C+155°C; Weight: NA; Height: 0.55MM; Distributor_part_number: 311-4.7KJRCT-ND; Distributor_name: DIGIKEY; Package: 0402; Wattage: 1/16W; Tolerance: 5%; PCB Footprint: RES0402
R218 = RESISTOR_Dup5: RES 10K 1/16W 5% 0402; Part_type: RESISTORS\FIXED; Mfr_part_number: RC0402JR-0710KL; Mfr_name: YAGEO AMERICA; Mistral Part No: 110009030208-R; Custom_Duty: 15%; Customs_HS_Code: 85332119; Voltage: NA; Project: HSE; NI_MARK: DNI; Footprint Path: Y:\MIS_DATABASE\Library\ALTIUM_TOOL\PCB_FOOTPRINTS\Altium_Footprint_Lib.PcbLib; Library Path: Y:\MIS_DATABASE\Library\ALTIUM_TOOL\SCHEMATICS_PARTS\MS_DISCRETE_Library.schlib; Footprint Ref: RES0402_0-5; Library Ref: RESISTOR; PCB Footprint: RES0402_0-5; MECHANICAL 3D STEP FILE: RES0402_0-5; RoHS: Pb-Free; Chkd/date: VASANTHA/061216; Crtd /date: MAZHAR/230805; Datasheet: Y:\MIS_DATABASE\DATASHEETS\RESISTORS\YAGEO-RC0402.PDF; Temperature: -55°C+155°C; Weight: 0.65mg; Height: 0.40MM; Distributor_part_number: 311-10KJRCT-ND; Distributor_name: DIGIKEY; Package: 0402; Wattage: 1/16W; Tolerance: 5%
R221 R227 = RESISTOR_Dup5: RES 10K 1/16W 5% 0402; Mistral Part No: 110009030208-R; Mfr_name: YAGEO AMERICA; Mfr_part_number: RC0402JR-0710KL; Part_type: RESISTORS\FIXED; Project: HSE; Voltage: NA; Customs_HS_Code: 85332119; Custom_Duty: 15%; Footprint Path: Y:\MIS_DATABASE\Library\ALTIUM_TOOL\PCB_FOOTPRINTS\Altium_Footprint_Lib.PcbLib; Library Path: Y:\MIS_DATABASE\Library\ALTIUM_TOOL\SCHEMATICS_PARTS\MS_DISCRETE_Library.schlib; Footprint Ref: RES0402_0-5; Library Ref: RESISTOR; Tolerance: 5%; Wattage: 1/16W; Package: 0402; Distributor_name: DIGIKEY; Distributor_part_number: 311-10KJRCT-ND; Height: 0.40MM; Weight: 0.65mg; Temperature: -55°C+155°C; Datasheet: Y:\MIS_DATABASE\DATASHEETS\RESISTORS\YAGEO-RC0402.PDF; Crtd /date: MAZHAR/230805; Chkd/date: VASANTHA/061216; RoHS: Pb-Free; MECHANICAL 3D STEP FILE: RES0402_0-5; PCB Footprint: RES0402_0-5
R222 = RESISTOR_Dup5: RES 100E 1/16W 5% 0402; Mistral Part No: 110009030164-R; Mfr_name: VISHAY; Mfr_part_number: CRCW0402100RJNED; Part_type: RESISTORS\FIXED; Project: TI_MAXIE_CPB; Voltage: NA; Customs_HS_Code: 85332119; Custom_Duty: 15%; Library Ref: RESISTOR; Tolerance: 5%; Wattage: 1/16W; Package: 0402; Distributor_name: DIGIKEY; Distributor_part_number: 541-100JCT-ND; Height: 0.40MM; Weight: 0.65mg; Temperature: -55°C+155°C; Datasheet: Y:\MIS_DATABASE\DATASHEETS\RESISTORS\CRCW0603.PDF; Crtd /date: MANIRAJA/230817; Chkd/date: MANIRAJA/230817; MECHANICAL 3D STEP FILE: RES0402_0-5; PCB Footprint: RES0402_0-5
R223 R233 R543 = RESISTOR_Dup5: RES 33E 1/16W 1% 0402; Mistral Part No: 110014110006-R; Mfr_name: PANASONIC-ECG; Mfr_part_number: ERJ-2RKF33R0X; Part_type: RESISTORS\FIXED; Project: ZK BIOMETRIC; Voltage: NA; Customs_HS_Code: 85332119; Custom_Duty: 15%; Library Ref: RESISTOR; Tolerance: 1%; Wattage: 1/16W; Package: 0402; Distributor_name: DIGIKEY; Distributor_part_number: P33.0LCT-ND; Height: 0.40MM; Weight: 0.8g/1000pcs; Temperature: -55°C+125°C; Datasheet: Y:\MIS_DATABASE\DATASHEETS\RESISTORS\PAN-ERJSERIES.PDF; Crtd /date: JEBRAN/171114; Chkd/date: VASANTHA/061216; MECHANICAL 3D STEP FILE: RES0402_0-5; PCB Footprint: RES0402_0-5
R229 = RESISTOR_Dup5: RES 100E 1/16W 5% 0402; Part_type: RESISTORS\FIXED; Mfr_part_number: CRCW0402100RJNED; Mfr_name: VISHAY; Mistral Part No: 110009030164-R; Custom_Duty: 15%; Customs_HS_Code: 85332119; Voltage: NA; Project: TI_MAXIE_CPB; Library Ref: RESISTOR; MECHANICAL 3D STEP FILE: RES0402_0-5; Chkd/date: MANIRAJA/230817; Crtd /date: MANIRAJA/230817; Datasheet: Y:\MIS_DATABASE\DATASHEETS\RESISTORS\CRCW0603.PDF; Temperature: -55°C+155°C; Weight: 0.65mg; Height: 0.40MM; Distributor_part_number: 541-100JCT-ND; Distributor_name: DIGIKEY; Package: 0402; Wattage: 1/16W; Tolerance: 5%; PCB Footprint: RES0402_0-5
R463 R466 = RESISTOR_Dup4: RES 0E 1/16W 0402; Part_type: RESISTORS\FIXED; Mfr_part_number: CRCW04020000Z0ED; Mfr_name: VISHAY; Mistral Part No: 110010080019-P; Custom_Duty: 15%; Customs_HS_Code: 85332119; Voltage: NA; Project: PB_BUGBASE; NI_MARK: DNI; Footprint Path: Y:\MIS_DATABASE\Library\ALTIUM_TOOL\PCB_FOOTPRINTS\Altium_Footprint_Lib.PcbLib; Library Path: Y:\MIS_DATABASE\Library\ALTIUM_TOOL\SCHEMATICS_PARTS\MS_DISCRETE_Library.schlib; Footprint Ref: RES0402_0-5; Library Ref: RESISTOR; SIGNAL_MODEL: RES; MECHANICAL 3D STEP FILE: RES0402_0-5; RoHS: Pb-Free; Chkd/date: VASANTHA/201216; Crtd /date: MUDDU/190810; Datasheet: Y:\MIS_DATABASE\DATASHEETS\RESISTORS\CRCW0603.PDF; Temperature: -55°C+155°C; Weight: 0.65g/1000pcs; Height: 0.40MM; Distributor_part_number: 541-0.0JCT-ND; Distributor_name: DIGIKEY; Package: 0402; Wattage: 1/16W; Tolerance: NA; PCB Footprint: RES0402_0-5
R478 = RESISTOR_Dup2: RES 0E 1/16W 0402; Mistral Part No: 110010080019-P; Mfr_name: VISHAY; Mfr_part_number: CRCW04020000Z0ED; Part_type: RESISTORS\FIXED; Voltage: NA; Project: PB_BUGBASE; Customs_HS_Code: 85332119; Custom_Duty: 15%; Footprint Path: Y:\MIS_DATABASE\Library\ALTIUM_TOOL\PCB_FOOTPRINTS\Altium_Footprint_Lib.PcbLib; Library Path: Y:\MIS_DATABASE\Library\ALTIUM_TOOL\SCHEMATICS_PARTS\MS_DISCRETE_Library.schlib; Footprint Ref: RES0402_0-5; Library Ref: RESISTOR; MECHANICAL 3D STEP FILE: RES0402_0-5; Temperature: -55°C+155°C; Weight: 0.65g/1000pcs; PCB Footprint: RES0402_0-5; Tolerance: NA; Wattage: 1/16W; Package: 0402; Distributor_name: DIGIKEY; Distributor_part_number: 541-0.0JCT-ND; Height: 0.40MM; Datasheet: Y:\MIS_DATABASE\DATASHEETS\RESISTORS\CRCW0603.PDF; Crtd /date: MUDDU/190810; Chkd/date: VASANTHA/201216; RoHS: Pb-Free
R565 = RESISTOR_Dup5: RES 33E 1/16W 1% 0402; Part_type: RESISTORS\FIXED; Mfr_part_number: ERJ-2RKF33R0X; Mfr_name: PANASONIC-ECG; Mistral Part No: 110014110006-R; Custom_Duty: 15%; Customs_HS_Code: 85332119; Voltage: NA; Project: ZK BIOMETRIC; Library Ref: RESISTOR; MECHANICAL 3D STEP FILE: RES0402_0-5; Chkd/date: VASANTHA/061216; Crtd /date: JEBRAN/171114; Datasheet: Y:\MIS_DATABASE\DATASHEETS\RESISTORS\PAN-ERJSERIES.PDF; Temperature: -55°C+125°C; Weight: 0.8g/1000pcs; Height: 0.40MM; Distributor_part_number: P33.0LCT-ND; Distributor_name: DIGIKEY; Package: 0402; Wattage: 1/16W; Tolerance: 1%; PCB Footprint: RES0402_0-5
RA1 RA3 RA5 = RESARR_ISO8_0402: RES ARRAY 8 0E 0402; Part_type: RESISTORS\ARRAY; Mfr_part_number: EXB-2HVR000V; Mfr_name: PANASONIC-ECG; Mistral Part No: 110009030004-R; SIGNAL_MODEL: RESA; Project: V12SFP; Library Ref: RESARR_ISO8_0402; Chkd/date: SHREESHAIL/121205; Crtd /date: MAZHAR/300505; Datasheet: Y:\MIS_DATABASE\DATASHEETS\RESISTORS\EXB-2HV.PDF; Height: 0.55MM; Distributor_part_number: Y1000CT-ND; Distributor_name: DIGIKEY; Package: 0402; PCB Footprint: RESA_0402-8
RA9-RA11 = RESARR_ISO8_0402: RES ARRAY 8 0E 0402; Mistral Part No: 110009030004-R; Mfr_name: PANASONIC-ECG; Mfr_part_number: EXB-2HVR000V; Part_type: RESISTORS\ARRAY; SIGNAL_MODEL: RESA; Project: V12SFP; NI_MARK: DNI; Library Ref: RESARR_ISO8_0402; Package: 0402; Distributor_name: DIGIKEY; Distributor_part_number: Y1000CT-ND; Height: 0.55MM; Datasheet: Y:\MIS_DATABASE\DATASHEETS\RESISTORS\EXB-2HV.PDF; Crtd /date: MAZHAR/300505; Chkd/date: SHREESHAIL/121205; PCB Footprint: RESA_0402-8
U37 = TXS0102DCUR_VSSOP8: IC 2BIT BI-DIR VOLTAGE-LEVEL TRANSLATOR US8(VSSOP8); Mistral Part No: 141009030376-R; Mfr_name: TEXAS INSTRUMENTS; Part_type: ICS\INTERFACE\LEVEL TRANSLATOR; Project: SD_WATERLOO; Tolerance: NA; Customs_HS_Code: 85423100; Custom_Duty: 15%; Footprint Ref: VSSOP8_19-68_85X95_0-9; Library Ref: TXS0102DCUR_VSSOP8; Mfr_part_number: TXS0102DCUR; Voltage: NA; Wattage: NA; Package: US8; Distributor_name: DIGIKEY; Distributor_part_number: 296-21931-1-ND; Height: 0.90MM; Weight: 9.6mg; Temperature: -40°C+85°C; Datasheet: Y:\MIS_DATABASE\DATASHEETS\ICS\INTERFACE\TXS0102.PDF; Crtd /date: SHREESHAIL/190108; Chkd/date: MANIRAJA/130617; MECHANICAL 3D STEP FILE: VSSOP8_19-68_85X95_0-9; Library Path: Y:\MIS_DATABASE\Library\ALTIUM_TOOL\SCHEMATICS_PARTS\MS_MISCINTERFACE_Library.schlib; Footprint Path: Y:\MIS_DATABASE\Library\ALTIUM_TOOL\PCB_FOOTPRINTS\Altium_Footprint_Lib.PcbLib; PCB Footprint: VSSOP8_19-68_85X95_0-9
U39 U90 = SN74LVC1G32DBVR_SOT23-5: IC SINGAL 2 INPUT POSITIVE OR GATE SOT23-5; Mistral Part No: 141009030236-R; Mfr_name: TEXAS INSTRUMENTS; Part_type: ICS\DIGITAL\GATES; Project: SVDO_RMB_MMA; Tolerance: NA; Customs_HS_Code: 85423100; Custom_Duty: 15%; Library Ref: SN74LVC1G32DBVR_SOT23-5; PCB Footprint: SOT23-5_1-5; Mfr_part_number: SN74LVC1G32DBVR; Voltage: NA; Wattage: NA; Package: SOT23-5; Distributor_name: DIGIKEY; Distributor_part_number: 296-9847-1-ND; Height: 1.45MM; Weight: 6.3mg; Temperature: -40°C+85°C; Datasheet: Y:\MIS_DATABASE\DATASHEETS\ICS\DIGITAL\GATES\SN74LVC1G32.PDF; Crtd /date: MAZHAR/070806; Chkd/date: MANIRAJA/051017; MECHANICAL 3D STEP FILE: SOT23-5_1-5
U41 U92 = SN74LVC1G32DBVR_SOT23-5: IC SINGAL 2 INPUT POSITIVE OR GATE SOT23-5; Part_type: ICS\DIGITAL\GATES; Mfr_name: TEXAS INSTRUMENTS; Mistral Part No: 141009030236-R; Custom_Duty: 15%; Customs_HS_Code: 85423100; Wattage: NA; Project: SVDO_RMB_MMA; Library Ref: SN74LVC1G32DBVR_SOT23-5; PCB Footprint: SOT23-5_1-5; MECHANICAL 3D STEP FILE: SOT23-5_1-5; Chkd/date: MANIRAJA/051017; Crtd /date: MAZHAR/070806; Datasheet: Y:\MIS_DATABASE\DATASHEETS\ICS\DIGITAL\GATES\SN74LVC1G32.PDF; Temperature: -40°C+85°C; Weight: 6.3mg; Height: 1.45MM; Distributor_part_number: 296-9847-1-ND; Distributor_name: DIGIKEY; Package: SOT23-5; Voltage: NA; Tolerance: NA; Mfr_part_number: SN74LVC1G32DBVR
U42 = SN74CB3Q3257PWR_TSSOP16: IC 4BIT 1-OF-2 FET MULTIPLEXER/DEMULTIPLEXER TSSOP16; Mistral Part No: 141009030117-R; Mfr_name: TEXAS INSTRUMENTS; Part_type: ICS\DIGITAL\COMBINATIONAL; Project: OMAP_EVM; Customs_HS_Code: 85423100; Custom_Duty: 15%; Library Ref: SN74CB3Q3257PWR_TSSOP16; Mfr_part_number: SN74CB3Q3257PWR; Package: TSSOP16; Distributor_name: DIGIKEY; Distributor_part_number: 296-19138-1-ND; Height: 1.20MM; Temperature: -40°C+85°C; Datasheet: Y:\MIS_DATABASE\DATASHEETS\ICS\DIGITAL\COMBINATIONAL\SN74CB3Q3257.PDF; Crtd /date: USMAN/060109; Chkd/date: SUHAS/251010; RoHS: Sb/ Br FREE; PCB Footprint: TSSOP16_25-59_205X180